# EAGLE design dsl-lights (EAGLE 7.3.0)
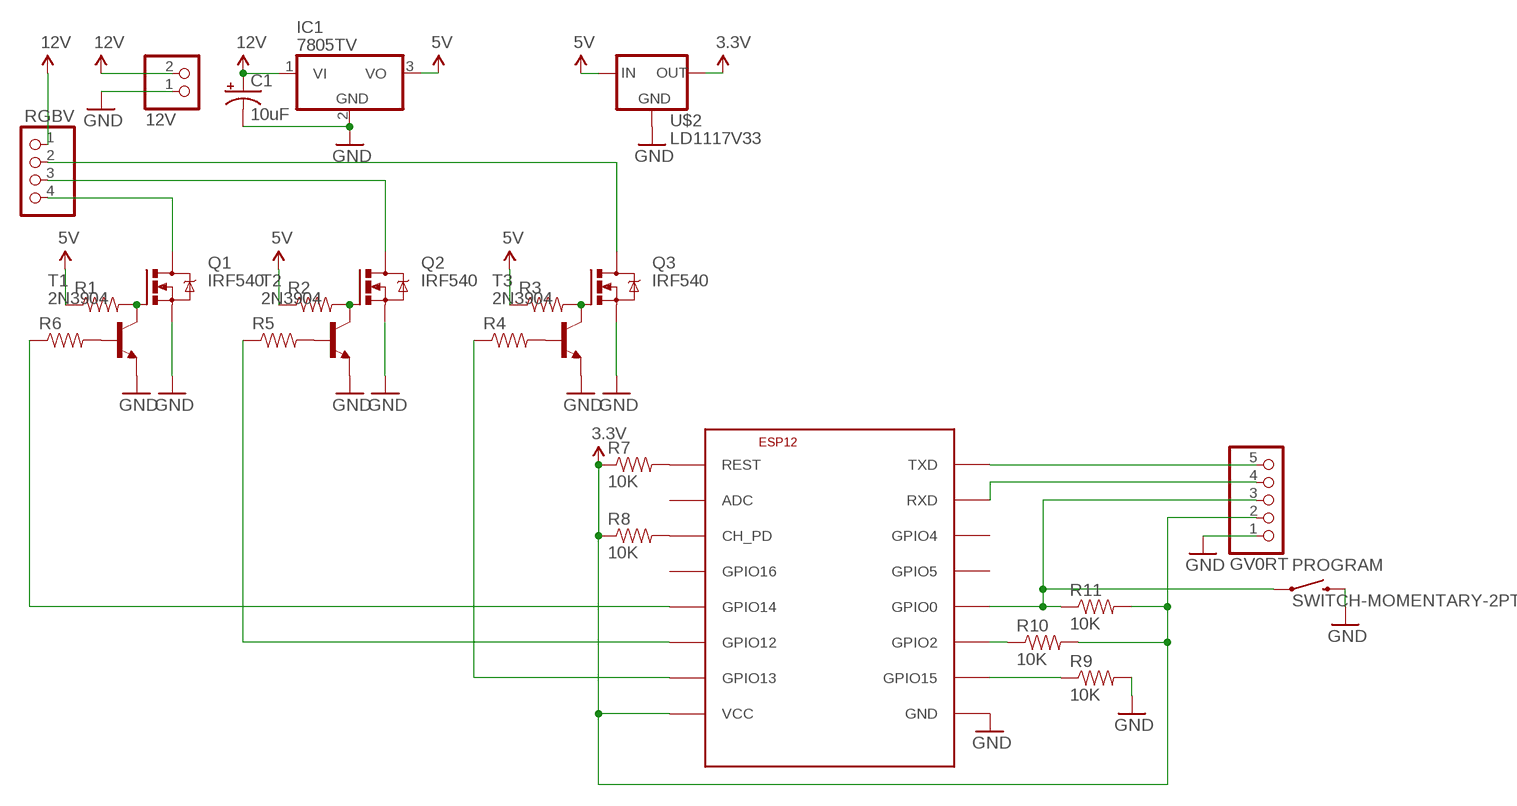
[diagram p0: schematic, sheet 1]

## Parts
12V  HEADER-1X2  [1X02_OVAL]
C1  10uF  CAP_POLPTH1  [CPOL-RADIAL-100UF-25V]
ESP12  ESP8266-12  [ESP-12]
GV0RT  HEADER-1X5  [1X05_OVAL]
IC1  7805TV  [TO220V]
PROGRAM  SWITCH-MOMENTARY-2PTH  [TACTILE-PTH]
Q1  IRF540  [TO220BV]
Q2  IRF540  [TO220BV]
Q3  IRF540  [TO220BV]
R1  RESISTORAXIAL-0.3  [AXIAL-0.3]
R2  RESISTORAXIAL-0.3  [AXIAL-0.3]
R3  RESISTORAXIAL-0.3  [AXIAL-0.3]
R4  RESISTORAXIAL-0.3  [AXIAL-0.3]
R5  RESISTORAXIAL-0.3  [AXIAL-0.3]
R6  RESISTORAXIAL-0.3  [AXIAL-0.3]
R7  10K  RESISTORAXIAL-0.3  [AXIAL-0.3]
R8  10K  RESISTORAXIAL-0.3  [AXIAL-0.3]
R9  10K  RESISTORAXIAL-0.3  [AXIAL-0.3]
R10  10K  RESISTORAXIAL-0.3  [AXIAL-0.3]
R11  10K  RESISTORAXIAL-0.3  [AXIAL-0.3]
RGBV  HEADER-1X4  [1X04_OVAL]
T1  2N3904  [TO92]
T2  2N3904  [TO92]
T3  2N3904  [TO92]
U$2  LD1117V33  V_REG_LD1117VXX  [78XXL]

## Nets
3.3V: ESP12.VCC GV0RT.2 R7.P$1 R8.P$1 R10.P$2 R11.P$2 U$2.GND(OUT)
5V: IC1.3(VO) R1.P$1 R2.P$1 R3.P$1 U$2.OUT(IN)
12V [high power]: 12V.2 C1.1(+) IC1.1(VI) RGBV.1
GND [high power]: 12V.1 C1.2(-) ESP12.GND GV0RT.1 IC1.2(GND) PROGRAM.3 Q1.S Q2.S Q3.S R9.P$2 T1.3(E) T2.3(E) T3.3(E) U$2.IN(GND)
N$1: Q2.G R2.P$2 T2.1(C)
N$2: Q3.G R3.P$2 T3.1(C)
N$3: Q1.G R1.P$2 T1.1(C)
N$4: R4.P$2 T3.2(B)
N$5: R5.P$2 T2.2(B)
N$6: R6.P$2 T1.2(B)
N$7 [high power]: Q1.D RGBV.4
N$8 [high power]: Q2.D RGBV.3
N$9 [high power]: Q3.D RGBV.2
N$10: ESP12.GPIO14 R6.P$1
N$11: ESP12.GPIO12 R5.P$1
N$12: ESP12.GPIO13 R4.P$1
N$13: ESP12.REST R7.P$2
N$14: ESP12.CH_PD R8.P$2
N$15: ESP12.GPIO15 R9.P$1
N$16: ESP12.GPIO2 R10.P$1
N$17: ESP12.GPIO0 GV0RT.3 PROGRAM.1 R11.P$1
N$20: ESP12.TXD GV0RT.5
N$21: ESP12.RXD GV0RT.4
Unconnected: ESP12.ADC ESP12.GPIO4 ESP12.GPIO5 ESP12.GPIO16

## Library data of the parts
12V = microbuilder:HEADER-1X2: PIN HEADER
C1 = SparkFun-Capacitors:CAP_POL: Capacitor Polarized These are standard SMD and PTH capacitors. Normally 10uF, 47uF, and 100uF in electrolytic and tantalum varieties. Always verify the external diameter of the through hole cap, it varies with capacity, voltage, and manufacturer. The EIA devices should be standard.
ESP12 = lio:ESP8266
GV0RT = microbuilder:HEADER-1X5: PIN HEADER
IC1 = linear:78*: Positive VOLTAGE REGULATOR Source: http://cache.national.com/ds/LM/LM78L05.pdf http://www.fairchildsemi.com/ds/LM/LM7805.pdf
PROGRAM = SparkFun-Electromechanical:SWITCH-MOMENTARY-2: Various NO switches- pushbuttons, reed, etc; PROD_ID: SWCH-08441
Q1-Q3 = transistor-power:IRF540: HEXFET Power MOSFET
R1-R11 = SparkFun-Passives:RESISTOR: Resistor Basic schematic elements and footprints for 0603, 1206, and PTH resistors.
RGBV = microbuilder:HEADER-1X4: PIN HEADER
T1-T3 = transistor-neu-to92:2N3904: NPN TRANSISTOR
U$2 = SparkFun-PowerIC:V_REG_LD1117VXX: LD1117VXX voltage regulator. We carry the 3.3V version (COM-00526) in TO-220 package.

## Net classes
1 high power: width 0.762 mm

## Board
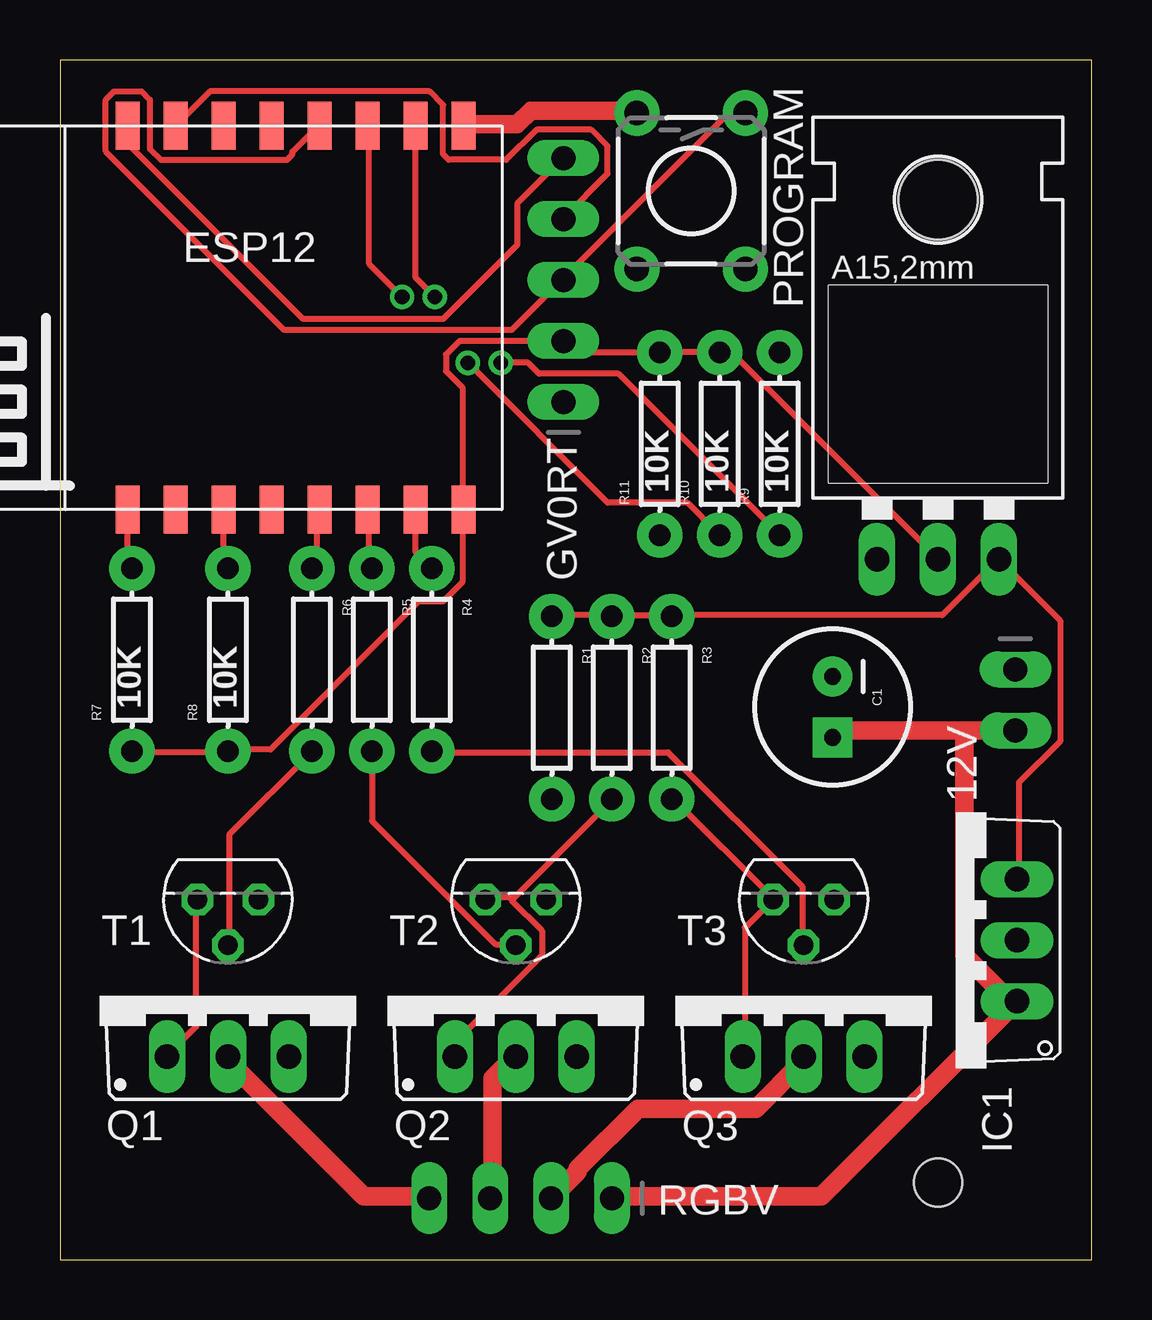
[diagram p1: board, top side]
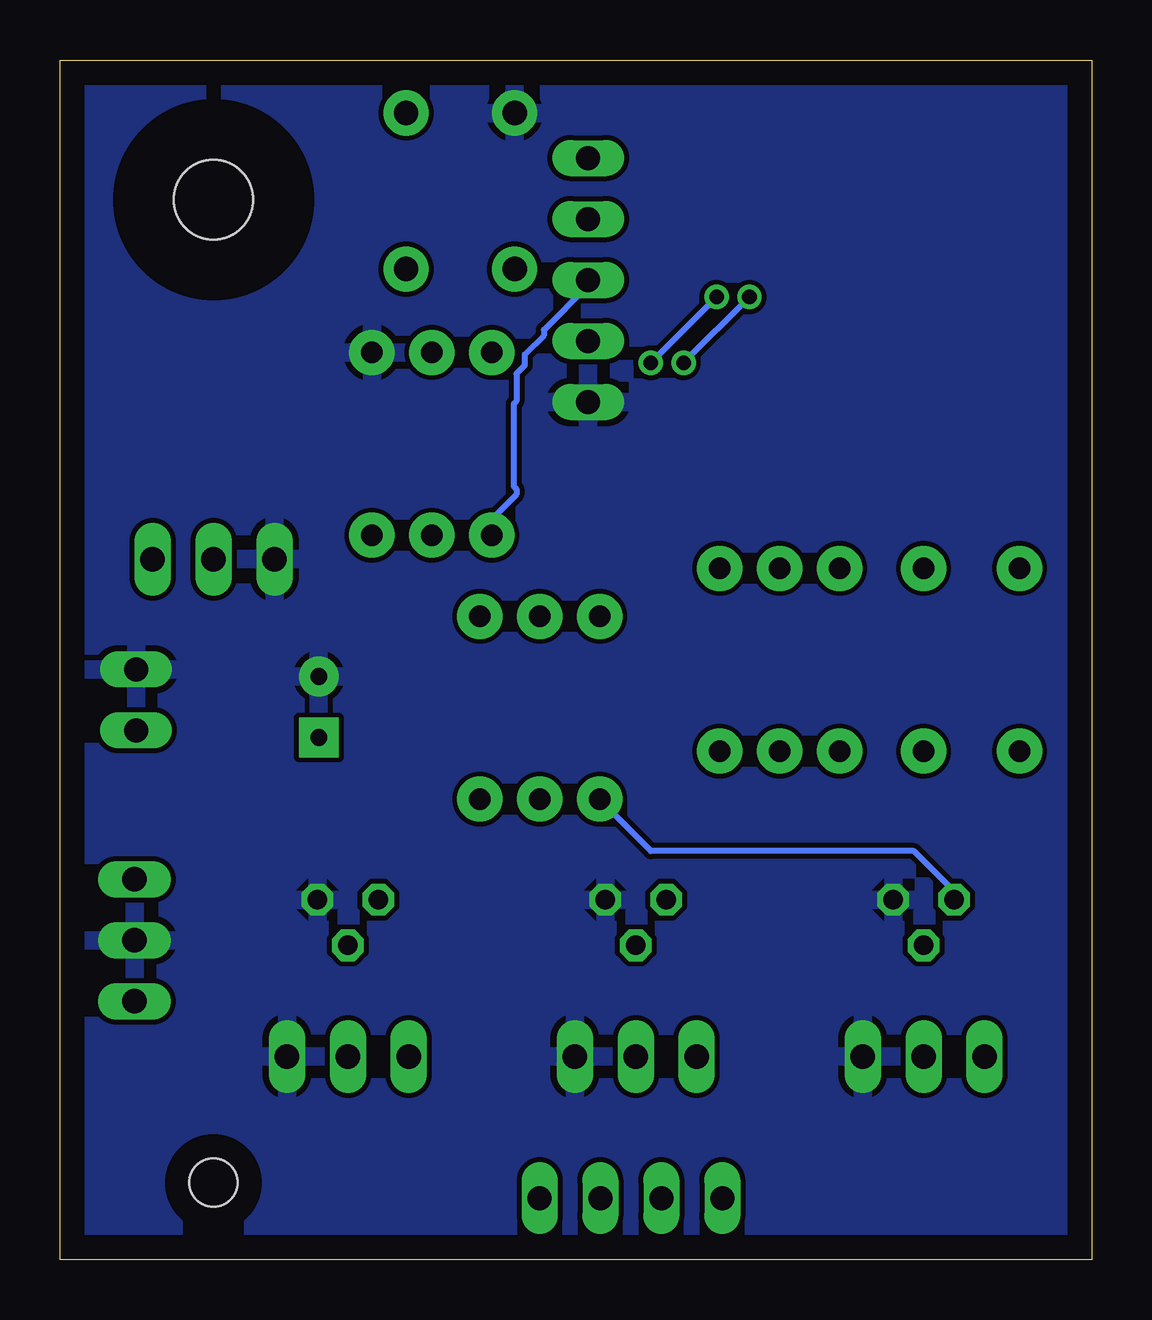
[diagram p2: board, bottom side, seen from below]

Size 43 x 50 mm. Coordinates in mm from the lower left corner, seen from the top.
Outline: 0,0 43,0 43,50 0,50 0,0
Copper layers (1*16): Top 0.035mm / dielectric 1.5mm / Bottom 0.035mm
Design rules "default": minimum track width 10mil, minimum drill 24mil, track to track 8mil, track to pad 8mil, pad to pad 8mil, via to via 8mil, smd to smd 8mil, copper to edge 40mil, drill to drill 8mil, minimum pad ring 10mil, minimum via ring 8mil, stop-mask expansion 4mil, vias tented up to drill 0mil, thermal gap 10mil
Holes 2 mm at 36.6,3.2

### Footprints (pad centres in the part's own frame; a part is rotated, then mirrored left to right if it is on the bottom)
1X02_OVAL = drill 1 long: 1 -1.27,0; 2 1.27,0
CPOL-RADIAL-100UF-25V = drill 0.7 pad 1.651 square: 1 1.27,0 | drill 0.7 pad 1.651: 2 -1.27,0
ESP-12 = smd 1 x 2: ADC -1.6,-8; CH_PD 0.4,-8; GND 10.4,8; GPIO0 4.4,8; GPIO2 6.4,8; GPIO4 0.4,8; GPIO5 2.4,8; GPIO12 6.4,-8; GPIO13 8.4,-8; GPIO14 4.4,-8; GPIO15 8.4,8; GPIO16 2.4,-8; REST -3.6,-8; RXD -1.6,8; TXD -3.6,8; VCC 10.4,-8
1X05_OVAL = drill 1 long: 1 -5.08,0; 2 -2.54,0; 3 0,0; 4 2.54,0; 5 5.08,0
TO220V = drill 1.016 long: 1 -2.54,-2.54; 2 0,-2.54; 3 2.54,-2.54
TACTILE-PTH = drill 1.016 pad 1.88: 1 -3.251,2.261; 2 3.251,2.261; 3 -3.251,-2.261; 4 3.251,-2.261
TO220BV = drill 1.016 long: D 0,-2.54; G -2.54,-2.54; S 2.54,-2.54
AXIAL-0.3 = drill 0.9 pad 1.88: P$1 -3.81,0; P$2 3.81,0
1X04_OVAL = drill 1 long: 1 -3.81,0; 2 -1.27,0; 3 1.27,0; 4 3.81,0
TO92 = drill 0.813 octagon: 1 1.27,0; 2 0,1.905; 3 -1.27,0
78XXL = drill 1.016 long: GND 0,-3.81; IN -2.54,-3.81; OUT 2.54,-3.81 | hole 3.302: 0,11.176

### Placement (x,y rotation side)
12V  39.83,23.33 270 top
C1  32.21,23.03 270 top
ESP12  6.42,39.26 0 top
GV0RT  20.98,40.83 90 top
IC1  37.35,13.31 90 top
PROGRAM  26.31,44.54 270 top
Q1  7,11 0 top
Q2  19,11 0 top
Q3  31,11 0 top
R1  20.5,23 270 top
R2  23,23 270 top
R3  25.5,23 270 top
R4  15.5,25 270 top
R5  13,25 270 top
R6  10.5,25 270 top
R7  3,25 90 top
R8  7,25 90 top
R9  30,34 90 top
R10  27.5,34 90 top
R11  25,34 90 top
RGBV  19.2,2.56 180 top
T1  7,15 180 top
T2  19,15 180 top
T3  31,15 180 top
U$2  36.6,33 0 top

### Tracks (layer width: path | path; a pad name or v marks a point on that pad's centre or on a via)
3.3V
  Top 0.254: U$2.GND 36.55,29.26 28.09,37.72 27.52,37.72 R10.P$2 27.4,37.83 25,37.83 R11.P$2 24.89,37.83 21.35,37.83 21,38.18 GV0RT.2 20.89,38.29 16.66,38.29 16.09,37.72 16.09,37.03 16.77,36.35 16.77,31.32 ESP12.VCC 16.77,31.2 16.77,28.23 15.97,27.43 14.95,27.43 8.77,21.26 7.06,21.26 R8.P$1 6.95,21.14 3.06,21.14 R7.P$1
5V
  Top 0.254: R1.P$1 20.55,26.86 22.95,26.86 R2.P$1 23.06,26.86 25.46,26.86 R3.P$1 25.58,26.86 36.78,26.86 39.06,29.15 U$2.OUT 39.18,29.15 41.69,26.63 41.69,21.6 39.98,19.89 39.98,15.89 IC1.3
12V
  Top 0.762: 37.69,22.06 33.46,22.06 32.05,22.05 C1.1 32.25,21.83 | 37.69,22.06 39.75,22.06 12V.2 | RGBV.1 23.06,2.63 31.75,2.63 39.86,10.74 IC1.1 39.52,10.86 37.69,12.69 37.69,22.06
GND
  Top 0.762: ESP12.GND 16.89,47.32 19.06,47.32 19.63,47.89 23.98,47.89 PROGRAM.3
  pour Bottom: 0.4,50.1 45.4,51.4 45.4,-2.6 0.3,-3.2
N$1
  Top 0.254: 18.83,15.09 18.95,15.09 22.95,19.09 R2.P$2 23.06,19.2 | 18.83,15.09 17.8,15.09 T2.1 | Q2.G 16.55,8.57 16.55,9.14 20.09,12.69 20.09,13.72 18.83,14.97 18.83,15.09
N$2
  Top 0.254: Q3.G 28.55,8.57 28.55,13.83 29.69,14.97 T3.1 29.69,15.09 25.58,19.2 R3.P$2
N$3
  Top 0.254: 20.55,19.2 R1.P$2 | T1.1 5.69,14.97 5.69,9.72 4.54,8.57 Q1.G
  Bottom 0.254: R1.P$2 20.43,19.09 18.38,17.03 7.4,17.03 5.8,15.43 5.8,15.09 T1.1
N$4
  Top 0.254: T3.2 30.95,13.14 30.95,15.54 25.35,21.14 15.52,21.14 R4.P$2
N$5
  Top 0.254: T2.2 18.95,13.14 18.15,13.14 13,18.29 13,21.14 R5.P$2
N$6
  Top 0.254: T1.2 7.06,13.14 7.06,17.72 10.49,21.14 R6.P$2
N$7
  Top 0.762: RGBV.4 15.29,2.63 12.66,2.63 7.06,8.23 7.06,8.46 Q1.D
N$8
  Top 0.762: RGBV.3 18.03,2.63 18.03,7.54 18.95,8.46 Q2.D
N$9
  Top 0.762: RGBV.2 20.55,2.63 21.57,3.66 21.57,3.77 24.09,6.29 29.01,6.29 30.95,8.23 30.95,8.46 Q3.D
N$10
  Top 0.254: ESP12.GPIO14 10.72,31.2 10.72,29.03 10.6,28.92 R6.P$1
N$11
  Top 0.254: ESP12.GPIO12 12.89,31.2 12.89,28.92 R5.P$1
N$12
  Top 0.254: ESP12.GPIO13 14.83,31.2 14.83,29.49 15.4,28.92 R4.P$1
N$13
  Top 0.254: ESP12.REST 2.83,31.2 2.83,29.03 2.94,28.92 R7.P$2
N$14
  Top 0.254: ESP12.CH_PD 6.83,31.2 6.83,29.03 6.95,28.92 R8.P$2
N$15  (via drill 0.61)
  Top 0.254: v15.63,40.12 14.83,40.92 14.83,47.21 ESP12.GPIO15 | v18.38,37.38 19.52,37.38 19.98,36.92 23.29,36.92 29.92,30.29 R9.P$1
  Bottom 0.254: v18.38,37.38 v15.63,40.12
N$16  (via drill 0.61)
  Top 0.254: v14.26,40.12 12.89,41.49 12.89,47.21 ESP12.GPIO2 | v17,37.38 22.83,31.55 26.15,31.55 27.4,30.29 R10.P$1
  Bottom 0.254: v17,37.38 v14.26,40.12
N$17
  Top 0.254: ESP12.GPIO0 10.72,47.21 9.69,46.18 9.69,46.06 9.46,45.83 4.2,45.83 3.74,46.29 3.74,48.35 3.4,48.69 2.26,48.69 1.91,48.35 1.91,46.18 9.34,38.75 18.83,38.75 20.89,40.8 GV0RT.3 21,40.92 27.86,47.78 28.55,47.78 PROGRAM.1
  Bottom 0.254: R11.P$1 24.89,30.29 24.89,30.98 23.98,31.89 23.98,32.12 24.09,32.23 24.09,35.66 23.98,35.78 23.98,36.92 23.63,37.26 23.63,37.72 22.83,38.52 22.83,38.75 21,40.58 21,40.8 GV0RT.3
N$20
  Top 0.254: ESP12.TXD 2.83,47.21 2.83,46.52 10.14,39.2 15.97,39.2 19.06,42.29 19.06,44.01 20.89,45.83 GV0RT.5
N$21
  Top 0.254: ESP12.RXD 4.89,47.32 6.26,48.69 15.4,48.69 15.97,48.12 15.97,46.06 16.2,45.83 18.6,45.83 19.86,47.09 22.15,47.09 22.83,46.41 22.83,45.26 21,43.43 GV0RT.4

### Text on the board
tValues: ;) | GND | Lio@DSL